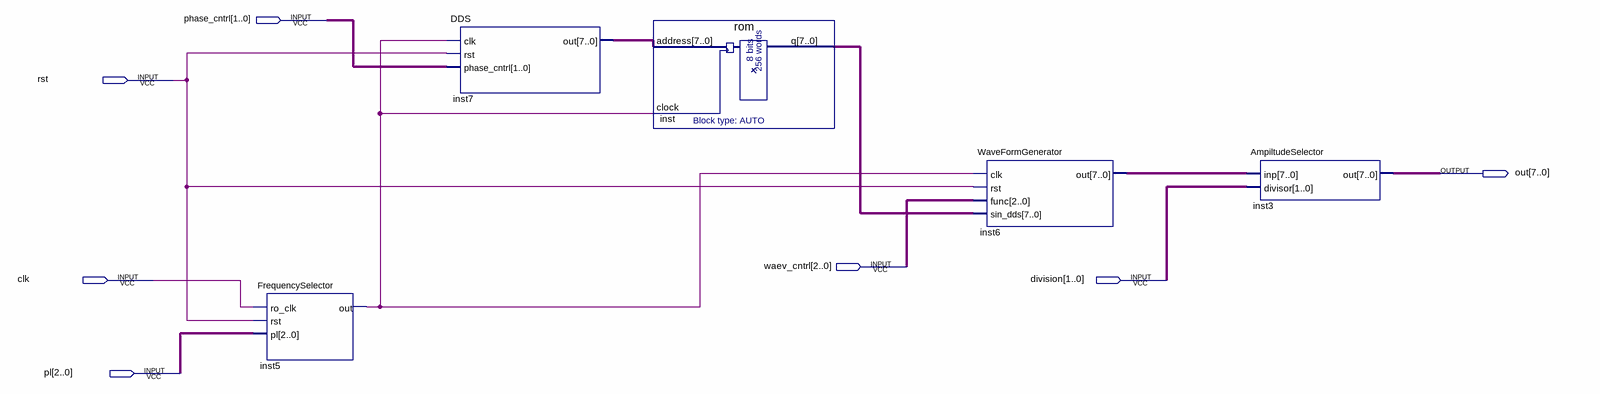
[diagram p0: schematic sheet]
// Quartus schematic Block1.bdf as structural Verilog: 5 symbols, 7 pins
module Block1 (
  input  [1:0] phase_cntrl,
  input  rst,
  input  [2:0] waev_cntrl,
  input  clk,
  input  [1:0] division,
  input  [2:0] pl,
  output [7:0] out
);

  wire inst5_out;
  wire [7:0] inst6_out, inst7_out, inst_q;

  FrequencySelector inst5 (.ro_clk(clk), .rst(rst), .pl(pl), .out(inst5_out));
  DDS inst7 (.clk(inst5_out), .rst(rst), .phase_cntrl(phase_cntrl), .out(inst7_out));
  rom inst (.address(inst7_out), .clock(inst5_out), .q(inst_q));
  WaveFormGenerator inst6 (.clk(inst5_out), .rst(rst), .func(waev_cntrl), .sin_dds(inst_q), .out(inst6_out));
  AmpiltudeSelector inst3 (.inp(inst6_out), .divisor(division), .out(out));
endmodule
